# EAGLE schematic myversion (EAGLE 7.6.0)
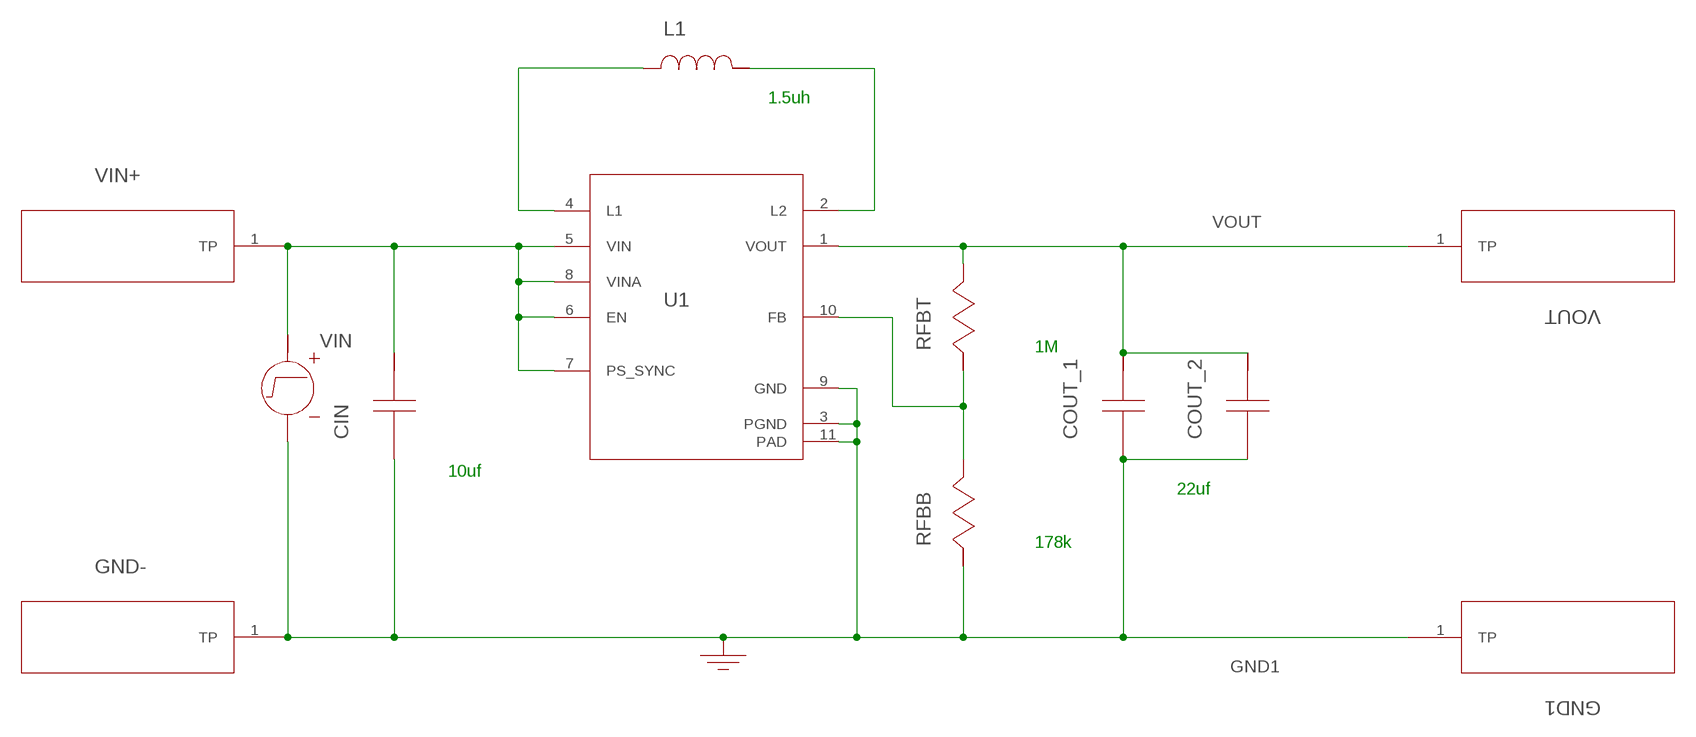
[diagram p0: schematic, sheet 1]

## Parts
CIN  LMK212BJ106KG-T  [0805]
COUT_1  LMK212BJ226MG-T  [0805]
COUT_2  LMK212BJ226MG-T  [0805]
GND  WB_GND  WB_GNDWB_GND  [WB_GND]
GND1  TP-1502  [TP-1502]
GND-  TP-1502  [TP-1502]
L1  LQM21PN1R5MC0D  [0805]
RFBB  CRCW0402178KFKED  [0402]
RFBT  CRCW04021M00FKED  [0402]
U1  TPS63000DRCR  [DRC0010J]
VIN  WB_STARTUP_VOLTAGE_SOURCE  WB_STARTUP_VOLTAGE_SOURCEWB_STARTUP_VOLTAGE_SOURCE  [WB_STARTUP_VOLTAGE_SOURCE]
VIN+  TP-1502  [TP-1502]
VOUT  TP-1502  [TP-1502]

## Nets
1: CIN.1 U1.5(VIN) U1.6(EN) U1.7(PS_SYNC) U1.8(VINA) VIN+.1(TP) VIN.1(+)
2: L1.1 U1.4(L1)
4: L1.2 U1.2(L2)
GND1: CIN.2 COUT_1.2 COUT_2.2 GND1.1(TP) GND-.1(TP) GND.1 RFBB.2 U1.3(PGND) U1.9(GND) U1.11(PAD) VIN.2(-)
N$2: RFBB.1 RFBT.2 U1.10(FB)
VOUT: COUT_1.1 COUT_2.1 RFBT.1 U1.1(VOUT) VOUT.1(TP)

## Notes on the sheet
- 1.5uh
- 1M
- 10uf
- 22uf
- 178k

## Library data of the parts
CIN = sps:LMK212BJ106KG-T
COUT_1 COUT_2 = sps:LMK212BJ226MG-T
GND = AcceleratedDesigns_Lib:WB_GND; MANUFACTURER_NAME: WB_GND; MANUFACTURER_PART_NUMBER: WB_GND; POWERPORTTYPE: POWER_GROUND; VALUE: Value
GND1 GND- VIN+ VOUT = sps:TP-1502
L1 = sps:LQM21PN1R5MC0D
RFBB = sps:CRCW0402178KFKED
RFBT = sps:CRCW04021M00FKED
U1 = sps:TPS63000DRCR
VIN = AcceleratedDesigns_Lib:WB_STARTUP_VOLTAGE_SOURCE; MANUFACTURER_NAME: WB_STARTUP_VOLTAGE_SOURCE; MANUFACTURER_PART_NUMBER: WB_STARTUP_VOLTAGE_SOURCE; POWERPORTTYPE: POWER_GROUND; VALUE: Value